# Altium schematic sheet AD7606.SchDoc
size OrCAD B
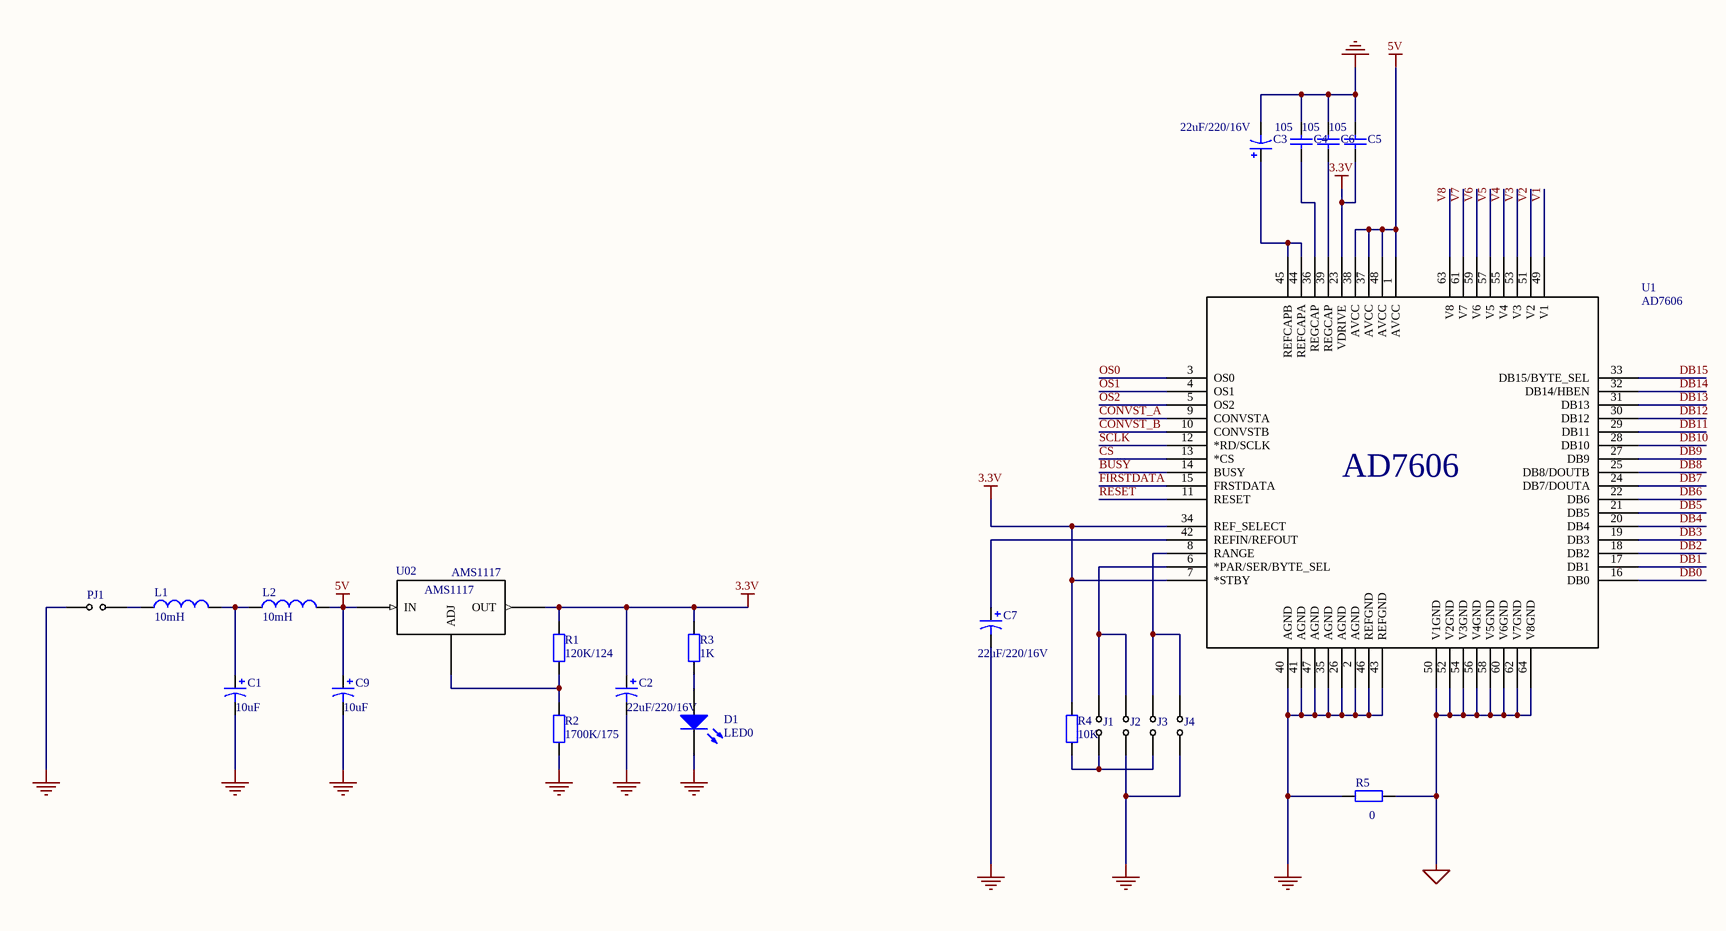
[diagram p0: AD7606.SchDoc]

## Parts
C1  value 10uF  [TCAP_SMD_2312_6032-28_C_M]  (hidden comment: Cap Pol1)
C2  value 22uF/220/16V  [TCAP_SMD_2312_6032-28_C_M]  (hidden comment: Cap Pol1)
C3  value 22uF/220/16V  [TCAP_SMD_2312_6032-28_C_M]  (hidden comment: Cap Pol1)
C4  value 105  [CAP_SMD_1206_3216_M]  (hidden comment: Cap)
C5  value 105  [CAP_SMD_1206_3216_M]  (hidden comment: Cap)
C6  value 105  [CAP_SMD_1206_3216_M]  (hidden comment: Cap)
C7  value 22uF/220/16V  [TCAP_SMD_2312_6032-28_C_M]  (hidden comment: Cap Pol1)
C9  value 10uF  [TCAP_SMD_2312_6032-28_C_M]  (hidden comment: Cap Pol1)
D1  LED0  [LED_SMD_0805_2012_M]
J1  head2  [HDR1X2]  (value not drawn)
J2  head2  [HDR1X2]  (value not drawn)
J3  head2  [HDR1X2]  (value not drawn)
J4  head2  [HDR1X2]  (value not drawn)
L1  value 10mH  [RES_SMD_0805_2012_M]  (hidden comment: Inductor)
L2  value 10mH  [RES_SMD_0805_2012_M]  (hidden comment: Inductor)
PJ1  head2  [HDR1X2]  (value not drawn)
R1  value 120K/124  [RES_SMD_1206_3216_M]  (hidden comment: Res2)
R2  value 1700K/175  [RES_SMD_1206_3216_M]  (hidden comment: Res2)
R3  value 1K  [RES_SMD_1206_3216_M]  (hidden comment: Res2)
R4  value 10K  [RES_SMD_1206_3216_M]  (hidden comment: Res2)
R5  value 0  [RES_SMD_1206_3216_M]  (hidden comment: Res2)
U1  AD7606  [AD7606]
U02  AMS1117  [SOT230P700X180-4N]

## Nets
3.3V: C2.1 C5.1 R1.2 R3.1 R4.2 U1.7(*STBY) U1.23(VDRIVE) U1.34(REF_SELECT) U02.2(OUT)
5V: C9.1 L2.2 U1.1(AVCC) U1.37(AVCC) U1.38(AVCC) U1.48(AVCC) U02.3(IN)
AGND: R5.2 U1.50(V1GND) U1.52(V2GND) U1.54(V3GND) U1.56(V4GND) U1.58(V5GND) U1.60(V6GND) U1.62(V7GND) U1.64(V8GND)
GND: C1.2 C2.2 C3.2 C4.2 C5.2 C6.2 C7.2 C9.2 D1.2(K) J2.1(Vss) J4.1(Vss) PJ1.1(Vss) R2.1 R5.1 U1.2(AGND) U1.26(AGND) U1.35(AGND) U1.40(AGND) U1.41(AGND) U1.43(REFGND) U1.46(REFGND) U1.47(AGND)
BUSY: U1.14(BUSY)
CONVST_A: U1.9(CONVSTA)
CONVST_B: U1.10(CONVSTB)
CS: U1.13(*CS)
DB0: U1.16(DB0)
DB1: U1.17(DB1)
DB2: U1.18(DB2)
DB3: U1.19(DB3)
DB4: U1.20(DB4)
DB5: U1.21(DB5)
DB6: U1.22(DB6)
DB7: U1.24(DB7/DOUTA)
DB8: U1.25(DB8/DOUTB)
DB9: U1.27(DB9)
DB10: U1.28(DB10)
DB11: U1.29(DB11)
DB12: U1.30(DB12)
DB13: U1.31(DB13)
DB14: U1.32(DB14/HBEN)
DB15: U1.33(DB15/BYTE_SEL)
FIRSTDATA: U1.15(FRSTDATA)
OS0: U1.3(OS0)
OS1: U1.4(OS1)
OS2: U1.5(OS2)
RESET: U1.11(RESET)
SCLK: U1.12(*RD/SCLK)
V1: U1.49(V1)
V2: U1.51(V2)
V3: U1.53(V3)
V4: U1.55(V4)
V5: U1.57(V5)
V6: U1.59(V6)
V7: U1.61(V7)
V8: U1.63(V8)
NetC1_1: C1.1 L1.2 L2.1
NetC3_1: C3.1 U1.44(REFCAPA) U1.45(REFCAPB)
NetC4_1: C4.1 U1.36(REGCAP)
NetC6_1: C6.1 U1.39(REGCAP)
NetC7_1: C7.1 U1.42(REFIN/REFOUT)
NetD1_1: D1.1(A) R3.2
NetJ1_1: J1.1(Vss) J2.2(Vss) U1.6(*PAR/SER/BYTE_SEL)
NetJ1_2: J1.2(Vss) J3.1(Vss) R4.1
NetJ3_2: J3.2(Vss) J4.2(Vss) U1.8(RANGE)
NetL1_1: L1.1 PJ1.2(Vss)
NetR1_1: R1.1 R2.2 U02.1(ADJ)

## Library data of the parts
C1-C3 C7 C9 = Cap Pol1: Polarized Capacitor (Radial); Published: 8-Jun-2000; LatestRevisionDate: 17-Jul-2002; LatestRevisionNote: Re-released for DXP Platform.; PackageReference: RB7.6-15; Publisher: Altium Limited; PackageDescription: Polarized Capacitor (Radial); 2 Leads
C4-C6 = Cap: Capacitor; Published: 8-Jun-2000; LatestRevisionDate: 17-Jul-2002; LatestRevisionNote: Re-released for DXP Platform.; PackageReference: RAD-0.3; Publisher: Altium Limited; PackageDescription: Radial Cap, Thru-Hole; 2 Leads; 0.3 in Pin Spacing
D1 = LED0: Typical INFRARED GaAs LED; Published: 8-Jun-2000; LatestRevisionDate: 08-Jul-2005; LatestRevisionNote: Mech Layer 1 removed.; PackageReference: LED-0; Publisher: Altium Limited; PackageDescription: LED; 2 Leads
L1 L2 = Inductor: Code_IEC: 1005; Published: 8-Jun-2000; LatestRevisionDate: 29-May-2009; LatestRevisionNote: IPC-7351 Footprint Added.; PackageReference: 0402-A; Publisher: Altium Limited; PackageDescription: Chip Inductor; Code_JEITA: 0402
R1-R5 = Res2: Resistor; Published: 8-Jun-2000; LatestRevisionDate: 17-Jul-2002; LatestRevisionNote: Re-released for DXP Platform.; PackageReference: AXIAL-0.4; Publisher: Altium Limited; PackageDescription: Axial Device, Thru-Hole; 2 Leads; 0.4 in Pin Spacing